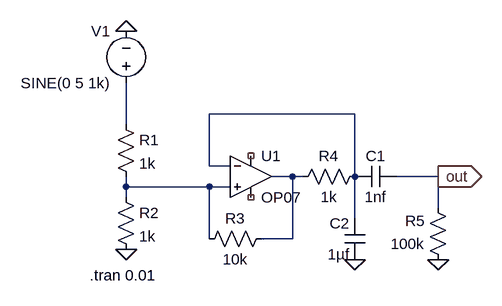
[diagram p0: schematic (10)triangular_wave_generator_using_op-amp[1].asc]
(10)triangular_wave_generator_using_op-amp[1].asc, the LTspice schematic file:
Version 4
SHEET 1 880 680
WIRE 368 32 144 32
WIRE 16 48 16 -16
WIRE 144 112 144 32
WIRE 176 112 144 112
WIRE 272 128 240 128
WIRE 288 128 272 128
WIRE 368 128 368 32
WIRE 496 128 432 128
WIRE 16 144 16 128
WIRE 144 144 16 144
WIRE 176 144 144 144
WIRE 16 160 16 144
WIRE 496 176 496 128
WIRE 368 192 368 128
WIRE 144 224 144 144
WIRE 272 224 272 128
WIRE 272 224 224 224
FLAG 16 240 0
FLAG 496 256 0
FLAG 496 128 out
IOPIN 496 128 Out
FLAG 16 -96 0
FLAG 368 256 0
SYMBOL OpAmps\\OP07 208 64 R0
SYMATTR InstName U1
SYMBOL res 0 32 R0
SYMATTR InstName R1
SYMATTR Value 1k
SYMBOL res 0 144 R0
SYMATTR InstName R2
SYMATTR Value 1k
SYMBOL res 240 208 R90
WINDOW 0 0 56 VBottom 2
WINDOW 3 32 56 VTop 2
SYMATTR InstName R3
SYMATTR Value 10k
SYMBOL res 384 112 R90
WINDOW 0 0 56 VBottom 2
WINDOW 3 32 56 VTop 2
SYMATTR InstName R4
SYMATTR Value 1k
SYMBOL res 512 272 R180
WINDOW 0 36 76 Left 2
WINDOW 3 36 40 Left 2
SYMATTR InstName R5
SYMATTR Value 100k
SYMBOL cap 432 112 R90
WINDOW 0 0 32 VBottom 2
WINDOW 3 32 32 VTop 2
SYMATTR InstName C1
SYMATTR Value 1nf
SYMBOL cap 384 256 R180
WINDOW 0 24 56 Left 2
WINDOW 3 24 8 Left 2
SYMATTR InstName C2
SYMATTR Value 1µf
SYMBOL voltage 16 0 R180
WINDOW 0 24 96 Left 2
WINDOW 3 24 16 Left 2
WINDOW 123 0 0 Left 0
WINDOW 39 0 0 Left 0
SYMATTR InstName V1
SYMATTR Value SINE(0 5 1k)
TEXT -40 280 Left 2 !.tran 0.01

The netlist it stands for:
* (10)triangular_wave_generator_using_op-amp[1].asc
XU1 N004 N001 NC_01 NC_02 N003 LT1001  ; OP07, pins In+ In- V+ V- OUT
R1 N002 N004 1k
R2 N004 0 1k
R3 N003 N004 10k
R4 N001 N003 1k
R5 0 out 100k
C1 out N001 1nf
C2 0 N001 1µf
V1 N002 0 SINE(0 5 1k)
.tran 0.01
.lib LTC.lib
.backanno
.end